# Altium schematic sheet POWER.SchDoc
size A4
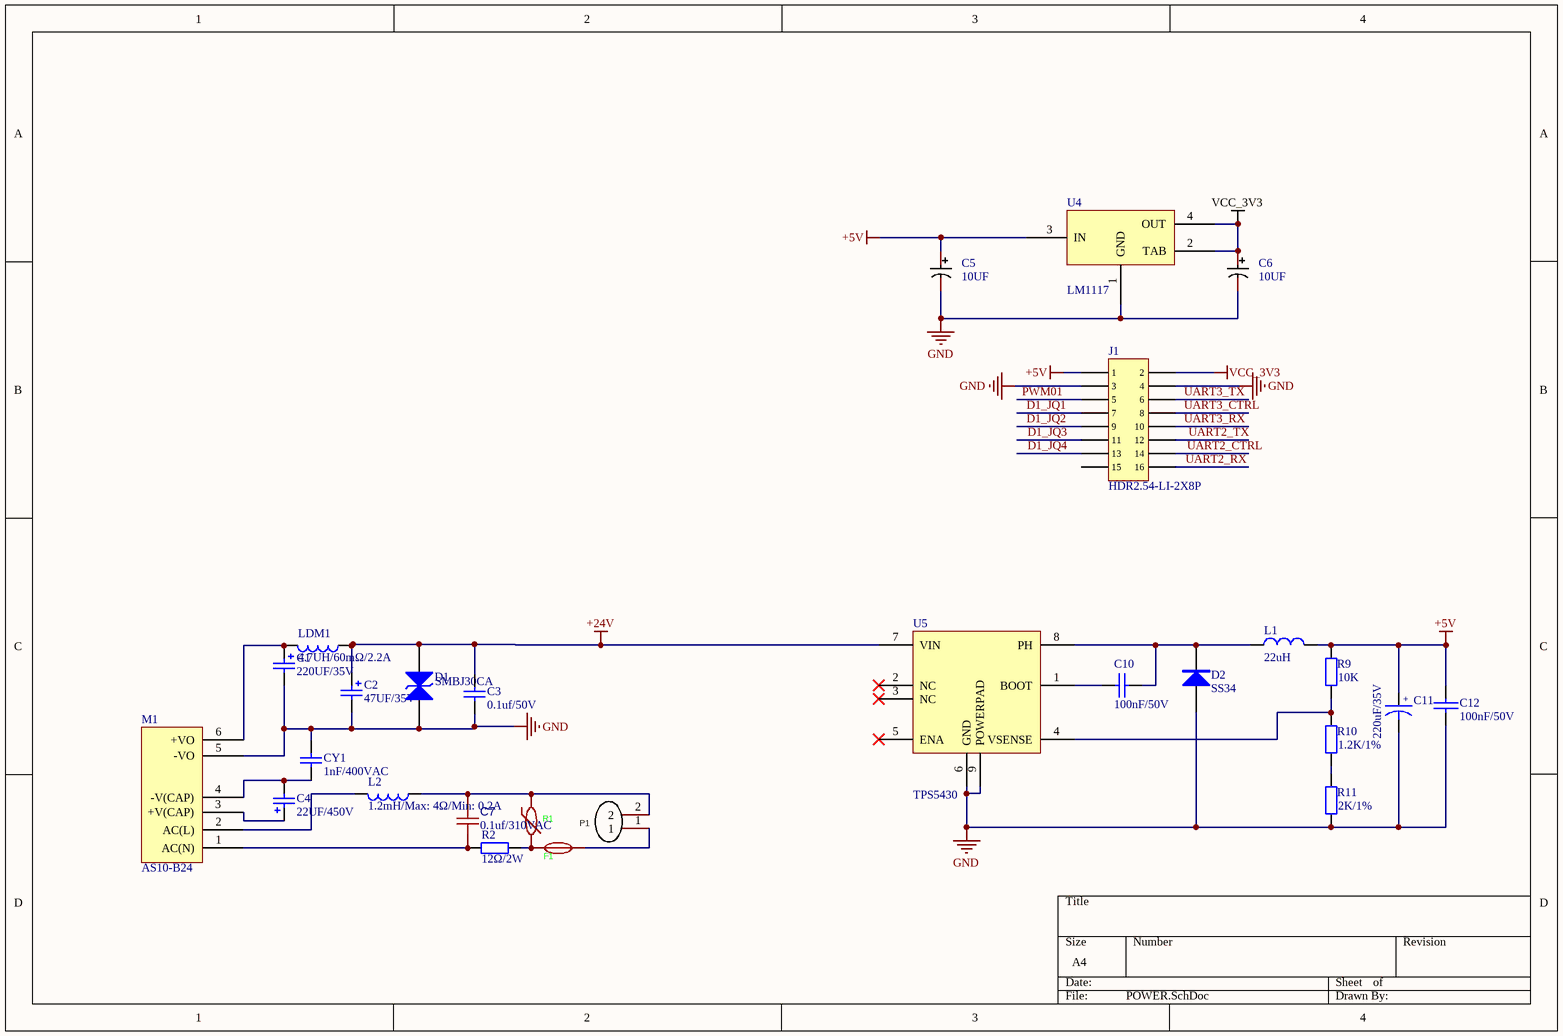
[diagram p0: POWER.SchDoc]

## Parts
C1  220UF/35V  [CAP-TH_BD8.0-P3.50-D0.6-FD]
C2  47UF/35V  [CAP-TH_BD6.3-P2.50-D1.0-FD]
C3  0.1uf/50V  [C-0603]
C4  22UF/450V  [CAP-TH_BD12.5-P5.00-D0.6-FD]
C5  10UF  [CAP-TH_BD5.0-P2.00-D0.8-FD]
C6  10UF  [CAP-TH_BD5.0-P2.00-D0.8-FD]
C7  0.1uf/310VAC  [CAP-TH_L18.0-W6.0-P15.00-D0.8]
C10  100nF/50V  [C-0805]
C11  220uF/35V  [CAP-TH_BD8.0-P3.50-D0.6-FD]
C12  100nF/50V  [C-0805]
CY1  1nF/400VAC  [CAP-TH_L7.5-W4.5-P10.00-D0.6]
D1  SMBJ30CA  [DO-214AA]
D2  SS34  [DO-214AC]
F1  SCF2A  [FUSE-SMD_L6.1-W2.6]  (value not drawn)
J1  HDR2.54-LI-2X8P  [IDC-TH_16P-P2.54_BOOMELE-2X8P]
L1  22uH  [L-CD75-2]
L2  1.2mH/Max: 4Ω/Min: 0.2A  [SRR1005-122K]
LDM1  4.7UH/60mΩ/2.2A  [L-NR5020]
M1  AS10-B24  [AS05-B24]
P1  WJ500V-5.08-2P  [KF128-2P DG128]  (value not drawn)
R1  14D561K  [10D561K]  (value not drawn)
R2  12Ω/2W  [RES-TH_BD5.5-L15.0-P19.00-D0.8]
R9  10K  [R-0805]
R10  1.2K/1%  [R-0805]
R11  2K/1%  [R-0805]
U4  LM1117  [SOT-223-3_L6.5-W3.4-P2.30-LS7.0-BR]
U5  TPS5430  [ESOP-8]

## Nets
+5V: C5.1 C11.1 C12.2 J1.1 L1.2 R9.2 U4.3(IN)
+24V: C2.1 C3.2 D1.1 LDM1.1 U5.7(VIN)
GND: C1.2 C2.2 C3.1 C5.2 C6.2 C11.2 C12.1 CY1.2 D1.2 D2.1(A) J1.3 J1.4 M1.5(-VO) R11.1 U4.1(GND) U5.6(GND) U5.9(POWERPAD)
VCC_3V3: C6.1 J1.2 U4.2(TAB) U4.4(OUT)
D1_JQ1: J1.7
D1_JQ2: J1.9
D1_JQ3: J1.11
D1_JQ4: J1.13
PWM01: J1.5
UART2_CTRL: J1.14
UART2_RX: J1.16
UART2_TX: J1.12
UART3_CTRL: J1.8
UART3_RX: J1.10
UART3_TX: J1.6
NetC1_1: C1.1 LDM1.2 M1.6(+VO)
NetC4_1: C4.1 M1.3(+V(CAP))
NetC4_2: C4.2 CY1.1 M1.4(-V(CAP))
NetC7_1: C7.1 M1.1(AC(N)) R2.2
NetC7_2: C7.2 L2.1 P1.2 R1.1
NetC10_1: C10.1 D2.2(K) L1.1 U5.8(PH)
NetC10_2: C10.2 U5.1(BOOT)
NetF1_1: F1.1 P1.1
NetF1_2: F1.2 R1.2 R2.1
NetL2_2: L2.2 M1.2(AC(L))
NetR9_1: R9.1 R10.2 U5.4(VSENSE)
NetR10_1: R10.1 R11.2

Not connected (* = marked no-connect by the designer): J1 15; U5 2(NC)* 3(NC)* 5(ENA)*

## Notes on the sheet
- (in symbol C电解电容) +

## Library data of the parts
C1 C2 C4 = CM-E 10uf 20% 25V: 铝电解电容
C3 CY1 = 0603' 100pF 5% 50V NP0 车规: 贴片电容; 品牌: 国巨; 华芯物料编号: HXE0202045001; 厂商型号: AC0603JRNPO9BN101
C5 C6 = KF470M050E110A: Manufacturer: CapXon(丰宾); Value: 470uF; Add into BOM: yes; Tolerance: ±20%; Rated Voltage: 50V; φD: 6.3mm; L: 11mm; Lifetime @ Temp: 2000hrs@105℃; Name: 10UF; Symbol: KF470M050E110A; Device: KF470M050E110A; Supplier: LCSC; Manufacturer Part: KF470M050E110A; Supplier Part: C59347; JLCPCB Part Class: 扩展库; LCSC Part Name: 47uF ±20% 50V; Supplier Footprint: 插件,D6.3xL11mm; Datasheet: https://atta.szlcsc.com/upload/public/pdf/source/20160702/1467448308274.pdf; Convert to PCB: yes; Lead Spacing: 2.5mm
C7 = PX104K2C1504: Symbol: PX104K2C1504
C10 C12 = C普通电容: 电容
C11 = C电解电容: 电解电容
D1 = DO-214AA' SMBJ30CA: TVS二极管
D2 = DIODE
F1 = SCF2A: 2A/300V; Manufacturer: TLC(竞沃); Add into BOM: yes; Type: 贴片式保险丝; Current Rating: 2A; Voltage Rating (AC): 300V; Voltage Rating (DC): 125V; Melting I2t: 0.53; Symbol: SCF2A; Device: SCF2A; LCSC Part Name: 2410快断 300V 2A 一次性贴片保险丝; Supplier Part: C2979801; Manufacturer Part: SCF2A; Supplier Footprint: 2410; JLCPCB Part Class: Extended Part; Datasheet: https://item.szlcsc.com/datasheet/SCF2A/3398474.html; Supplier: LCSC; Convert to PCB: yes; Operating Temperature: -55℃~+125℃; Length: 8.7mm; Height: 2.9mm
J1 = HDR2.54-LI-2X8P: 直插立式双排针
L1 = L: 功率电感
L2 = 1206' 100uH 10%: 贴片电感（SRR1005-122K）; 华芯物料编号: HXE0300300001; 品牌: *; 厂商型号: *
LDM1 = 1206' 100uH 10%: 贴片电感; 华芯物料编号: HXE0300300001; 品牌: *; 厂商型号: *
P1 = WJ500V-5.08-2P: Manufacturer: KANGNEX(康奈克斯电气); Symbol: WJ500V-5.08-2P-14-00A; Add into BOM: yes; Pitch: 5.08mm; Structure: 1x2P; Number of PINs Per Row: 2; Current Rating (Max): 18A; Voltage Rating (Max): 250V; Wire Gauge - AWG: 14~30; Wire Gauge - mm2: 2.5; Name: WJ500V-5.08-2P; Device: WJ500V-5.08-2P; LCSC Part Name: 5.08mm 1x2P 排数:1 每排P数:2 直针 可拼接; Supplier Part: C8465; Manufacturer Part: WJ500V-5.08-2P; Supplier Footprint: 插件,P=5.08mm; JLCPCB Part Class: Extended Part; Datasheet: https://atta.szlcsc.com/upload/public/pdf/source/20191225/C8465_02D34CE5B5B4A53DF5891601D97FA9F4.pdf; Supplier: LCSC; Convert to PCB: yes; Number of Rows: 1; Mounting Style: 直针; Operating Temperature Range: -40℃~+105℃; Color: 绿色
R1 = VDR-14D561K: Manufacturer: VDR(嵩隆); Add into BOM: yes; Varistor Voltage: 504V~616V; Clamping Voltage: 920V; Maximum DC Volts: 460V; Maximum AC Volts: 350V; Peak Current: 4.5kA; Energy: 127J; Value: 360pF@1kHz; Rated Wattage: 600mW; Symbol: VDR-14D561K; Device: VDR-14D561K; LCSC Part Name: 钳位电压920V 127焦耳 插件压敏电阻; Supplier Part: C273568; Manufacturer Part: VDR-14D561K; Supplier Footprint: 插件,P=7.5mm; JLCPCB Part Class: Extended Part; Datasheet: https://item.szlcsc.com/datasheet/VDR-14D561K/261874.html; Supplier: LCSC; Convert to PCB: yes
R2 = 1206' 512: 贴片电阻
R9-R11 = RES: 电阻; Value: 5.1K; Published: 8-Jun-2000; LatestRevisionDate: 17-Jul-2002; LatestRevisionNote: Re-released for DXP Platform.; PackageReference: AXIAL-0.4; Publisher: Altium Limited